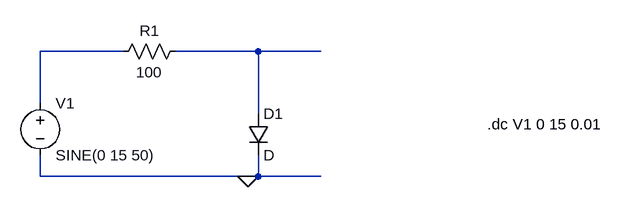
[diagram p0: schematic 2022023_1.asc]
2022023_1.asc, the LTspice schematic file:
Version 4
SHEET 1 880 680
WIRE -176 -128 -304 -128
WIRE 32 -128 -96 -128
WIRE 128 -128 32 -128
WIRE -304 -48 -304 -128
WIRE 32 -32 32 -128
WIRE -304 64 -304 32
WIRE 16 64 -304 64
WIRE 32 64 32 32
WIRE 32 64 16 64
WIRE 128 64 32 64
FLAG 16 64 0
SYMBOL voltage -304 -64 R0
WINDOW 123 0 0 Left 0
WINDOW 39 0 0 Left 0
SYMATTR InstName V1
SYMATTR Value SINE(0 15 50)
SYMBOL res -80 -144 R90
WINDOW 0 0 56 VBottom 2
WINDOW 3 32 56 VTop 2
SYMATTR InstName R1
SYMATTR Value 100
SYMBOL diode 16 -32 R0
SYMATTR InstName D1
TEXT 384 -16 Left 2 !.dc V1 0 15 0.01

The netlist it stands for:
* 2022023_1.asc
V1 N001 0 SINE(0 15 50)
R1 N002 N001 100
D1 N002 0 D
.model D D
.lib standard.dio
.dc V1 0 15 0.01
.backanno
.end